# Altium schematic sheet LTR-329ALS-01 StemmaQT.SchDoc
size 279 x 215 mm; Address4: USA
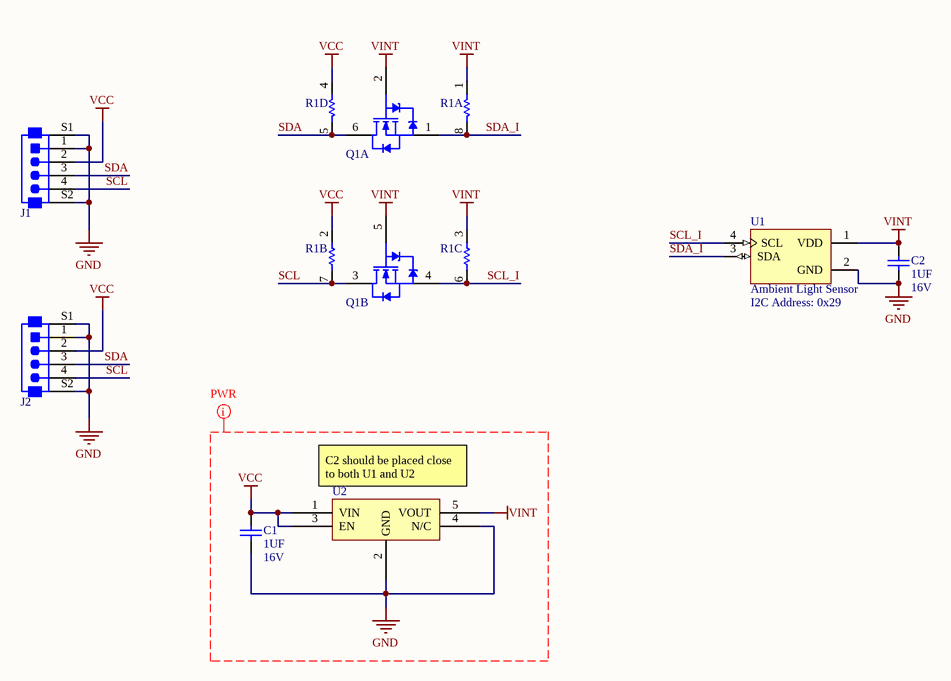
[diagram p0: LTR-329ALS-01 StemmaQT.SchDoc]

## Parts
C1  Val: 1UF  Vol: 16V  [0603_CAP]  (hidden comment: CAP 0603 1UF 16V 10% X7R)
C2  Val: 1UF  Vol: 16V  [0603_CAP]  (hidden comment: CAP 0603 1UF 16V 10% X7R)
J1  4 Pin, 1mm  [SM04B-SRSS-TB]  (value not drawn)
J2  4 Pin, 1mm  [SM04B-SRSS-TB]  (value not drawn)
Q1  Dual N-Channel MOSFET  [SOT363]  (value not drawn)  (parts A,B of 2)
R1  10k ohm resistor array  [CAY16-J4]  (value not drawn)  (parts A,B,C,D of 4)
U1  Ambient Light Sensor  I2C Address: 0x29  [LTR-329ALS-01-MFG]
U2  2.5V LDO  [SOT23-5]  (value not drawn)

## Nets
GND: C1.1 C2.1 J1.1 J1.S1(SHIELD) J1.S2(SHIELD) J2.1 J2.S1(SHIELD) J2.S2(SHIELD) U1.2(GND) U2.2(GND) U2.4(N/C)
VCC: C1.2 J1.2 J2.2 R1.2 R1.4 U2.1(VIN) U2.3(EN)
VINT: C2.2 Q1.2(G1) Q1.5(G2) R1.1 R1.3 U1.1(VDD) U2.5(VOUT)
SCL: J1.4 J2.4 Q1.3(D2) R1.7
SCL_I: Q1.4(S2) R1.6 U1.4(SCL)
SDA: J1.3 J2.3 Q1.6(D1) R1.5
SDA_I: Q1.1(S1) R1.8 U1.3(SDA)

## Layout directives
net class PWR: GND, VCC, VINT

## Notes on the sheet
- (near U2) C2 should be placed close to both U1 and U2
- Title:
- Desc:
- Size:
- Date:
- File:
- Repo:
- US Letter
- Auth:
- Time:
- Sheet
- Proj:
- of

## Library data of the parts
C1 C2 = CAP 0603 1UF 16V 10% X7R: Capacitor Surface Mount 0603 Footprint 1UF 16V 10% Tolerance Ceramic X7R; Manufacturer: Various; PCB Package: 0603; Description in Visual: Cap SMT 0603 1UF 16V 10% Ceramic X7R; P/N: CAP 0603 1UF 16V 10% X7R; Manufacturer P/N: Various; Value: 1UF; Voltage: 16V; Tolerance: 10%; Type: Ceramic X7R; ComponentLink1Description: Manufacturer Website; ComponentLink2Description: Component Datasheet; ComponentLink3Description: Octopart Link; Supplier 1: Digi-Key; Supplier Part Number 1: 1276-1943-1-ND; Supplier 2: Digi-Key; Supplier Part Number 2: 311-1446-1-ND; Supplier 3: Digi-Key; Supplier Part Number 3: 587-3305-1-ND; Supplier 4: Digi-Key; Supplier Part Number 4: 399-7847-1-ND
J1 J2 = SM04B-SRSS-TB: JST 4-Pin SR Series, SMD (1MM, 4 Pos); Manufacturer: J.S.T. Mfg. Co.,Ltd; Manufacturer P/N: SM04B-SRSS-TB(LF)(SN); Number of Contacts: 4; P/N: SM04B-SRSS-TB; Description in Visual: JST 4-Pin SR Series, SMD (1MM, 4 Pos); Type: SR; Orientation: Horizontal; Mount: SMD; ComponentLink1Description: Manufacturer Website; ComponentLink1URL: http://www.jst-mfg.com/index_e.php; ComponentLink2Description: Component Datasheet; ComponentLink2URL: http://www.jst-mfg.com/product/pdf/eng/eSH.pdf; Supplier 1: Digi-Key; Supplier Part Number 1: 455-1804-6-ND; ClassName: EDGE
Q1 = BSS138BKS: Dual N-Channel Trench MOSFET, 60 V, 0.32 A SOT-363; Manufacturer: NXP Semiconductors; Manufacturer P/N: BSS138BKS,115; Description in Visual: Mosfet Array 2 N-Channel (Dual) 60V 320mA 445mW Surface Mount 6-TSSOP SOT-363; VDSS (V): 60; VGSS (V): +/-20; ID (mA): 320; P/N: BSS138BKS; Configuration: Dual N-Channel; PCB Package: SOT-363; ComponentLink1Description: Manufacturer Website; ComponentLink1URL: #http://www.nxp.com/#; ComponentLink2Description: Component Datasheet; ComponentLink2URL: http://www.nxp.com/documents/data_sheet/BSS138BKS.pdf; ComponentLink4Description: Package Specification; ComponentLink4URL: http://www.nxp.com/documents/outline_drawing/sot363_po.pdf; Supplier 1: Digi-Key; Supplier Part Number 1: 1727-6478-1-ND
R1 = CAY16-103J4LF: 10k Ohm ±5% 62.5mW Power Per Element Isolated  Resistor Network/Array ±200ppm/°C 1206 (3216 Metric), Convex, Long Side Terminals; Manufacturer: Bourns Inc.; Description in Visual: RES ARRAY 4 RES 10K OHM 1206; P/N: CAY16-103J4LF; Manufacturer P/N: CAY16-103J4LF; PCB Package: CAY16-J4; Value: 10K; Power Rating: 62.5mW; Tolerance (%): 5%; Quantity: 4; Temperature Coefficient: ±200ppm/°C; ComponentLink1Description: Manufacturer Website; ComponentLink1URL: #https://www.bourns.com/#; ComponentLink2Description: Component Datasheet; ComponentLink2URL: #https://www.bourns.com/docs/Product-Datasheets/CATCAY.pdf#; ComponentLink3Description: Octopart Link; ComponentLink3URL: #https://octopart.com/cay16-103j4lf-bourns-152968?r=sp#; Supplier 1: Digi-Key; Supplier Part Number 1: CAY16-103J4LFCT-ND
U1 = LTR-329ALS-01: Optical Sensor Ambient  I²C 4-VDFN; Manufacturer: Lite-On Inc.; Vs (min) (V): 2.40; Vs (max) (V): 3.60; Vout (V): Open Drain; PCB Package: VDFN-4; P/N: LTR-329ALS-01; Manufacturer P/N: LTR-329ALS-01; Description in Visual: Optical Sensor Ambient  I²C 4-VDFN; Operating Temperature Range: -30°C to 70°C; ComponentLink1Description: Manufacturer's Website; ComponentLink1URL: https://www.liteon.com/en-us; ComponentLink2Description: Component Datasheet; ComponentLink2URL: https://optoelectronics.liteon.com/upload/download/DS86-2014-0006/LTR-329ALS-01_DS_V1.pdf; Supplier 1: Digi-Key; Supplier Part Number 1: 160-2160-1-ND
U2 = LP5907MFX-2.5: Linear Voltage Regulator IC  1 Output  250mA SOT-23-5; Manufacturer: Texas Insturments; Manufacturer P/N: LP5907MFX-2.5/NOPB; Description in Visual: IC REG LINEAR 2.5V 250MA SOT23-5; Vin Min (Volts): 2.75; Vin Max (Volts): 5.5; Quiescent Current (mA): 0.025; Layout Considerations: See Datasheet Page 18; P/N: LP5907MFX-2.5; Type: LDO; Features: Control; Output Current: 250mA; Output Voltage (Volts): 2.5V; Temperature Range: -40°C - 125°C; PCB Package: SOT23-5; ComponentLink1Description: Manufacturer's Website; ComponentLink1URL: http://www.ti.com##; ComponentLink2Description: Component Datasheet; ComponentLink2URL: https://www.ti.com/lit/ds/symlink/lp5907.pdf?HQS=TI-null-null-digikeymode-df-pf-null-wwe&ts=1595385050787; Supplier 1: Digi-Key; Supplier Part Number 1: 296-40356-1-ND